# EAGLE design LS027B7DH01_Breakout (EAGLE 9.4.1)

## Sheet 1 of 2
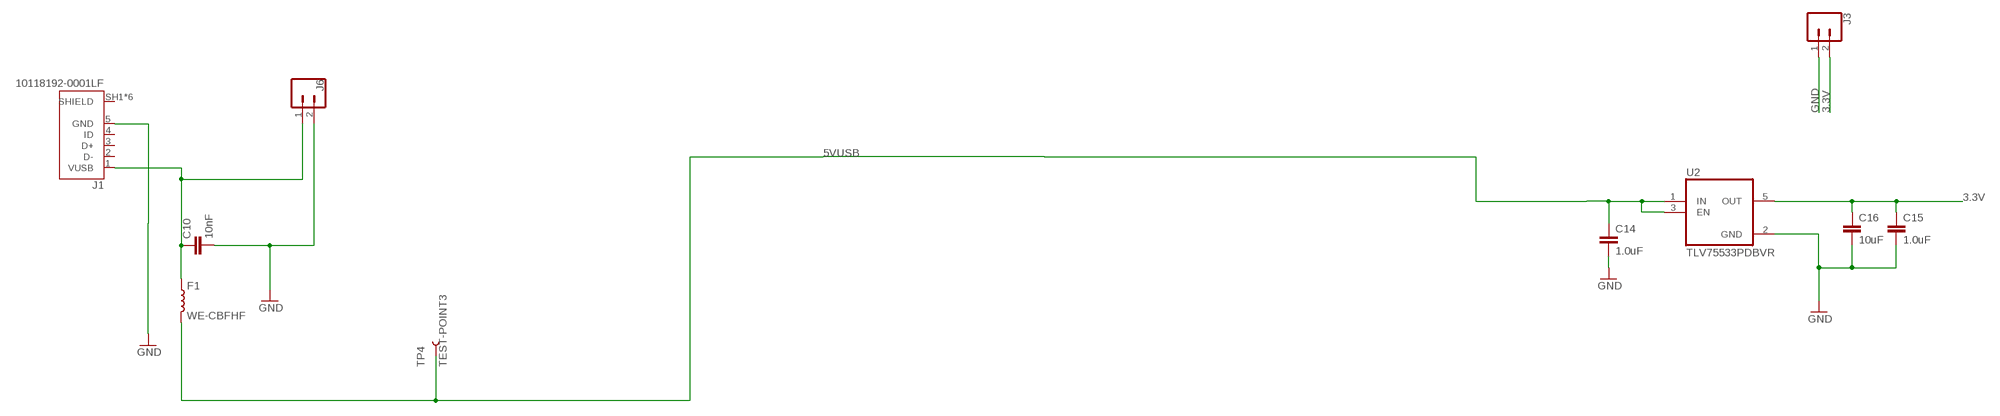
[diagram p0: schematic, sheet 1]

### Parts
C10  10nF  10NF-0603-50V-10%  [0603]
C14  1.0uF  SPARKFUN-CAPACITORS_1.0UF-0603-16V-10%  [SPARKFUN-CAPACITORS_0603]
C15  1.0uF  SPARKFUN-CAPACITORS_1.0UF-0603-16V-10%  [SPARKFUN-CAPACITORS_0603]
C16  10uF  10UF-0603-6.3V-20%  [0603]
F1  WE-CBFHF  [0603]
J1  10118192-0001LF  [AMPHENOL_10118192-0001LF]
J3  CONN_02  [1X02]
J6  CONN_02  [1X02]
TP4  TEST-POINT3  [PAD.03X.03]
U2  TLV75533PDBVR  [SOT95P280X145-5N]

### Nets
3.3V: C15.1 C16.1 J3.2 U2.5(OUT) ; also sheet 2
5VUSB [linear regulators]: C14.1 F1.2 TP4.P$1 U2.1(IN) U2.3(EN)
GND [ground]: C10.2 C14.2 C15.2 C16.2 J1.5(GND) J3.1 J6.2 U2.2(GND) ; also sheet 2
VBUS: C10.1 F1.1 J1.1(VUSB) J6.1
Unconnected: J1.2(D-) J1.3(D+) J1.4(ID) J1.SH1(SHIELD) J1.SH2(SHIELD) J1.SH3(SHIELD) J1.SH4(SHIELD) J1.SH5(SHIELD) J1.SH6(SHIELD)

## Sheet 2 of 2
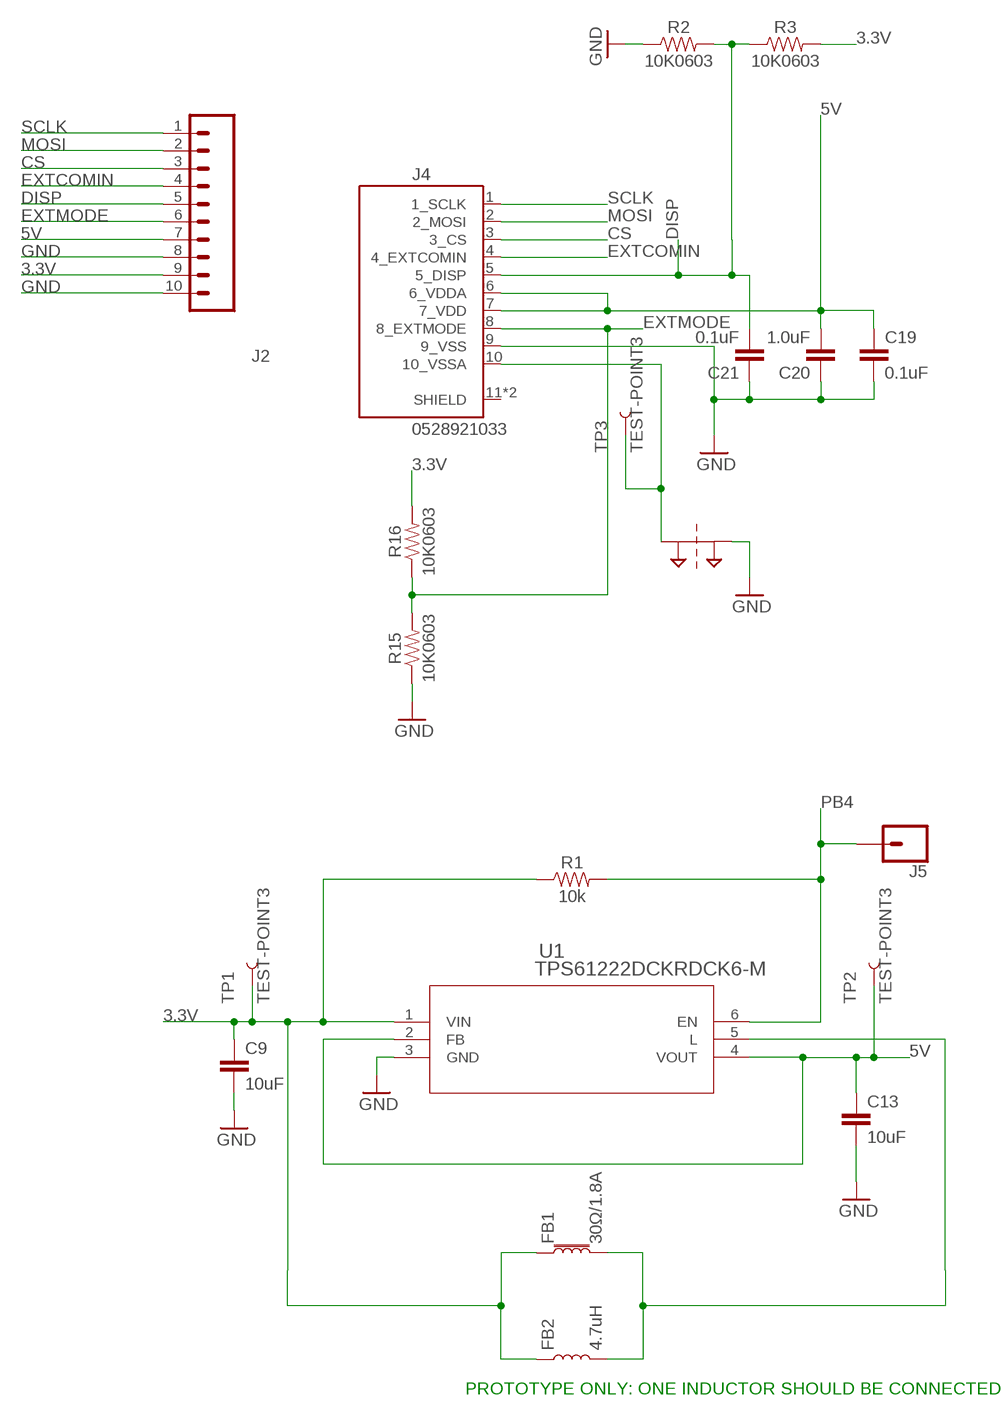
[diagram p1: schematic, sheet 2]

### Parts
C9  10uF  10UF-0603-6.3V-20%  [0603]
C13  10uF  10UF-0603-6.3V-20%  [0603]
C19  0.1uF  0.1UF-0603-25V-5%  [0603]
C20  1.0uF  1.0UF-0603-16V-10%  [0603]
C21  0.1uF  0.1UF-0603-25V-5%  [0603]
FB1  30Ω/1.8A  FERRITE_BEAD-0603  [0603]
FB2  4.7uH  CIG22H4R7MNE  [CIG22H4R7MNE]
J2  CONN_10"  [1X10]
J4  0528921033  [MOLEX_0528921033]
J5  CONN_01  [1X01]
R1  10k  SPARKFUN-RESISTORS_10KOHM-0603-1/10W-1%  [SPARKFUN-RESISTORS_0603:1]
R2  10K0603  [0603]
R3  10K0603  [0603]
R15  10K0603  [0603]
R16  10K0603  [0603]
SUPPLY1  2PT_GND_TIE  [2PT_GND_TIE]
TP1  TEST-POINT3  [PAD.03X.03]
TP2  TEST-POINT3  [PAD.03X.03]
TP3  TEST-POINT3  [PAD.03X.03]
U1  TPS61222DCKRDCK6-M  [DCK6-M]

### Nets
3.3V: C9.1 FB1.1 FB2.1 J2.9 R1.1 R3.2 R16.2 TP1.P$1 U1.1(VIN) ; also sheet 1
5V: C13.1 C19.1 C20.2 J2.7 J4.6(6_VDDA) J4.7(7_VDD) TP2.P$1 U1.2(FB) U1.4(VOUT)
ARTN [ground]: J4.10(10_VSSA) SUPPLY1.P$1 TP3.P$1
CS: J2.3 J4.3(3_CS)
DISP: C21.2 J2.5 J4.5(5_DISP) R2.2 R3.1
EXTCOMIN: J2.4 J4.4(4_EXTCOMIN)
EXTMODE: J2.6 J4.8(8_EXTMODE) R15.2 R16.1
GND [ground]: C9.2 C13.2 C19.2 C20.1 C21.1 J2.8 J2.10 J4.9(9_VSS) R2.1 R15.1 SUPPLY1.P$2 U1.3(GND) ; also sheet 1
MOSI: J2.2 J4.2(2_MOSI)
N$5: FB1.2 FB2.2 U1.5(L)
PB4: J5.1 R1.2 U1.6(EN)
SCLK: J2.1 J4.1(1_SCLK)
Unconnected: J4.11(SHIELD) J4.12(SHIELD)

### Notes on the sheet
- PROTOTYPE ONLY: ONE INDUCTOR SHOULD BE CONNECTED ONLY

## Library data of the parts
C9 C13 C16 = Octal:10UF: 10.0µF ceramic capacitors A capacitor is a passive two-terminal electrical component used to store electrical energy temporarily in an electric field.; PROD_ID: CAP-11015
C10 = SparkFun-Capacitors:10NF: 0.01uF/10nF/10,000pF ceramic capacitors A capacitor is a passive two-terminal electrical component used to store electrical energy temporarily in an electric field. CAP-09321; PROD_ID: CAP-00867
C14 C15 = Octal:SPARKFUN-CAPACITORS_1.0UF: 1µF ceramic capacitors A capacitor is a passive two-terminal electrical component used to store electrical energy temporarily in an electric field.; PROD_ID: CAP-00868
C19 C21 = SparkFun-Capacitors:0.1UF: 0.1µF ceramic capacitors A capacitor is a passive two-terminal electrical component used to store electrical energy temporarily in an electric field.; PROD_ID: CAP-08604
C20 = SparkFun-Capacitors:1.0UF: 1µF ceramic capacitors A capacitor is a passive two-terminal electrical component used to store electrical energy temporarily in an electric field.; PROD_ID: CAP-00868
F1 = scottohair Tantalum:WE-CBFHF
FB1 = SparkFun-Coils:FERRITE_BEAD: Ferrite Bead (blocks, cores, rings, chokes, etc.) Inductor with layers of ferrite used to suppress high frequencies. Often used to isolate high frequency noise. SparkFun Products: IOIO-OTG - V2.2 <https://www.sparkfun.com/products/13613> SparkFun SAMD21 Mini Breakout <https://www.sparkfun.com/products/13664> SparkFun 6 Degrees of Freedom Breakout - LSM6DS3 <https://www.sparkfun.com/products/13339> SparkFun SAMD21 Dev Breakout <https://www.sparkfun.com/products/13672>; PROD_ID: NDUC-07859
FB2 = Octal:CIG22H4R7MNE
J1 = Octal:10118192-0001LF: Single Port 5 Contact Horizontal Right Angle Shielded Micro B USB 2.0 Connector; AVAILABILITY: Unavailable; DESCRIPTION: Single Port 5 Contact Horizontal Right Angle Shielded Micro B USB 2.0 Connector; MF: Amphenol ICC; MP: 10118192-0001LF; PACKAGE: None; PRICE: None
J2 = SparkFun-Connectors:CONN_10: Multi connection point. Often used as Generic Header-pin footprint for 0.1 inch spaced/style header connections On any of the 0.1 inch spaced packages, you can populate with these: Break Away Headers - Straight <https://www.sparkfun.com/products/116> (PRT-00116) Break Away Male Headers - Right Angle <https://www.sparkfun.com/products/553> (PRT-00553) Female Headers <https://www.sparkfun.com/products/115> (PRT-00115) Break Away Headers - Machine Pin <https://www.sparkfun.com/products/117> (PRT-00117) Break Away Female Headers - Swiss Machine Pin <https://www.sparkfun.com/products/743> (PRT-00743) Arduino Stackable Header - 10 Pin <https://www.sparkfun.com/products/11376> (PRT-11376) For SCREWTERMINALS and SPRING TERMINALS visit here: Screw Terimnals on SparkFun.com <https://www.sparkfun.com/search/results?term=Screw+Terminals> (5mm/3.5mm/2.54mm spacing) This device is also useful as a general connection point to wire up your design to another part of your project. Our various solder wires solder well into these plated through hole pads. Hook-Up Wire - Assortment (Stranded, 22 AWG) <https://www.sparkfun.com/products/11375> (PRT-11375) Hook-Up Wire - Assortment (Solid Core, 22 AWG) <https://www.sparkfun.com/products/11367> (PRT-11367) View the entire wire category on our website here <https://www.sparkfun.com/categories/141> Special notes: Molex polarized connector foot print use with SKU : PRT-08231 with associated crimp pins and housings. 1MM SMD Version SKU: PRT-10208 NOTES ON THE VARIANTS LOCK and LOCK_LONGPADS... This footprint was designed to help hold the alignment of a through-hole component (i.e. 6-pin header) while soldering it into place. You may notice that each hole has been shifted either up or down by 0.005 of an inch from it's more standard position (which is a perfectly straight line). This slight alteration caused the pins (the squares in the middle) to touch the edges of the holes. Because they are alternating, it causes a "brace" to hold the component in place. 0.005 has proven to be the perfect amount of "off-center" position when using our standard breakaway headers. Although looks a little odd when you look at the bare footprint, once you have a header in there, the alteration is very hard to notice. Also,if you push a header all the way into place, it is covered up entirely on the bottom side.; PROD_ID: CONN-11563
J3 J6 = SparkFun-Connectors:CONN_02: Multi connection point. Often used as Generic Header-pin footprint for 0.1 inch spaced/style header connections On any of the 0.1 inch spaced packages, you can populate with these: Break Away Headers - Straight <https://www.sparkfun.com/products/116> (PRT-00116) Break Away Male Headers - Right Angle <https://www.sparkfun.com/products/553> (PRT-00553) Female Headers <https://www.sparkfun.com/products/115> (PRT-00115) Break Away Headers - Machine Pin <https://www.sparkfun.com/products/117> (PRT-00117) Break Away Female Headers - Swiss Machine Pin <https://www.sparkfun.com/products/743> (PRT-00743) For SCREWTERMINALS and SPRING TERMINALS visit here: Screw Terimnals on SparkFun.com <https://www.sparkfun.com/search/results?term=Screw+Terminals> (5mm/3.5mm/2.54mm spacing) This device is also useful as a general connection point to wire up your design to another part of your project. Our various solder wires solder well into these plated through hole pads. Hook-Up Wire - Assortment (Stranded, 22 AWG) <https://www.sparkfun.com/products/11375> (PRT-11375) Hook-Up Wire - Assortment (Solid Core, 22 AWG) <https://www.sparkfun.com/products/11367> (PRT-11367) View the entire wire category on our website here <https://www.sparkfun.com/categories/141> Special notes: Molex polarized connector foot print use with: PRT-08233 with associated crimp pins and housings. 2.54_SCREWTERM for use with PRT-10571. 3.5mm Screw Terminal footprints for PRT-08084 5mm Screw Terminal footprints for use with PRT-08432
J4 = Octal:0528921033: Conn FFC/FPC Connector SKT 10 POS 0.5mm Solder RA SMD Embossed T/R; AVAILABILITY: Unavailable; DESCRIPTION: Conn Ffc Bottom 10pos 0.50mm r/a; MF: Molex; MP: 0528921033; PACKAGE: None; PRICE: None
J5 = SparkFun-Connectors:CONN_01: Single connection point. Often used as Generic Header-pin footprint for 0.1 inch spaced/style header connections On any of the 0.1 inch spaced packages, you can populate with these: Break Away Headers - Straight <https://www.sparkfun.com/products/116> (PRT-00116) Break Away Male Headers - Right Angle <https://www.sparkfun.com/products/553> (PRT-00553) Female Headers <https://www.sparkfun.com/products/115> (PRT-00115) Break Away Headers - Machine Pin <https://www.sparkfun.com/products/117> (PRT-00117) Break Away Female Headers - Swiss Machine Pin <https://www.sparkfun.com/products/743> (PRT-00743) This device is also useful as a general connection point to wire up your design to another part of your project. Our various solder wires solder well into these plated through hole pads. Hook-Up Wire - Assortment (Stranded, 22 AWG) <https://www.sparkfun.com/products/11375> (PRT-11375) Hook-Up Wire - Assortment (Solid Core, 22 AWG) <https://www.sparkfun.com/products/11367> (PRT-11367) View the entire wire category on our website here <https://www.sparkfun.com/categories/141> Special notes: SMTSO-256-ET is a "flush mount" nut for a 4-40 screw. We mostly use this on specialty testbeds; it is a nice way to connect hardware to your PCB at an adjustable hieght. Also note, the SNAP packages are for using a snappable style connector. We sell a baggie of snaps and they are also used on two LilyPad designs: Snap Assortment - 30 pack (male and female) <https://www.sparkfun.com/products/11347> (DEV-11347) LilyPad Arduino SimpleSnap <https://www.sparkfun.com/products/10941> (DEV-10941) LilyPad SimpleSnap Protoboard <https://www.sparkfun.com/products/10940> (DEV-10940)
R1 = Octal:SPARKFUN-RESISTORS_10KOHM: 10kΩ resistor A resistor is a passive two-terminal electrical component that implements electrical resistance as a circuit element. Resistors act to reduce current flow, and, at the same time, act to lower voltage levels within circuits. - Wikipedia; PROD_ID: RES-00824
R2 R3 R15 R16 = scottohair Tantalum:10K: 10K resistor scottohair
SUPPLY1 = SparkFun-PowerSymbols:2PT_GND_TIE: Dual Ground Supply Power supply symbol for connecting two grounds. SparkFun Products: SparkFun AutoDriver - Stepper Motor Driver <https://www.sparkfun.com/products/11611>
TP1-TP4 = SparkFun-Connectors:TEST-POINT: SparkFun Test Points Bare copper test points for troubleshooting or In-Circuit-Testing. These are used by our Production team for verifying production board runs using pogo-pins on test beds. SparkFun Products: SparkFun LSM9DS1 Breakout <https://www.sparkfun.com/products/13284> SparkFun PSOC <https://www.sparkfun.com/products/13714> SparkFun Load Cell Amplifier <https://www.sparkfun.com/products/13879>
U1 = Octal:TPS61222DCKR; MANUFACTURER_PART_NUMBER: TPS61222DCKR; VENDOR: Texas Instruments
U2 = Octal:TLV75533PDBVR: 500mA Low-IQ Small-Size Low-Dropout (LDO) Regulator 5-SOT-23 -40 to 125; AVAILABILITY: Unavailable; DESCRIPTION: 500mA Low-IQ Small-Size Low-Dropout _LDO_ Regulator 5-SOT-23 -40 to 125; MF: Texas Instruments; MP: TLV75533PDBVR; PACKAGE: SOT-23 Texas Instruments; PRICE: None

## Net classes
1 ground: width 0.203 mm, clearance 0.203 mm
2 power: width 0.203 mm
3 cap sense: width 0.178 mm, clearance 0.635 mm
4 linear regulators: width 1.27 mm, clearance 0.381 mm
5 diff pair: width 0.203 mm

## Board
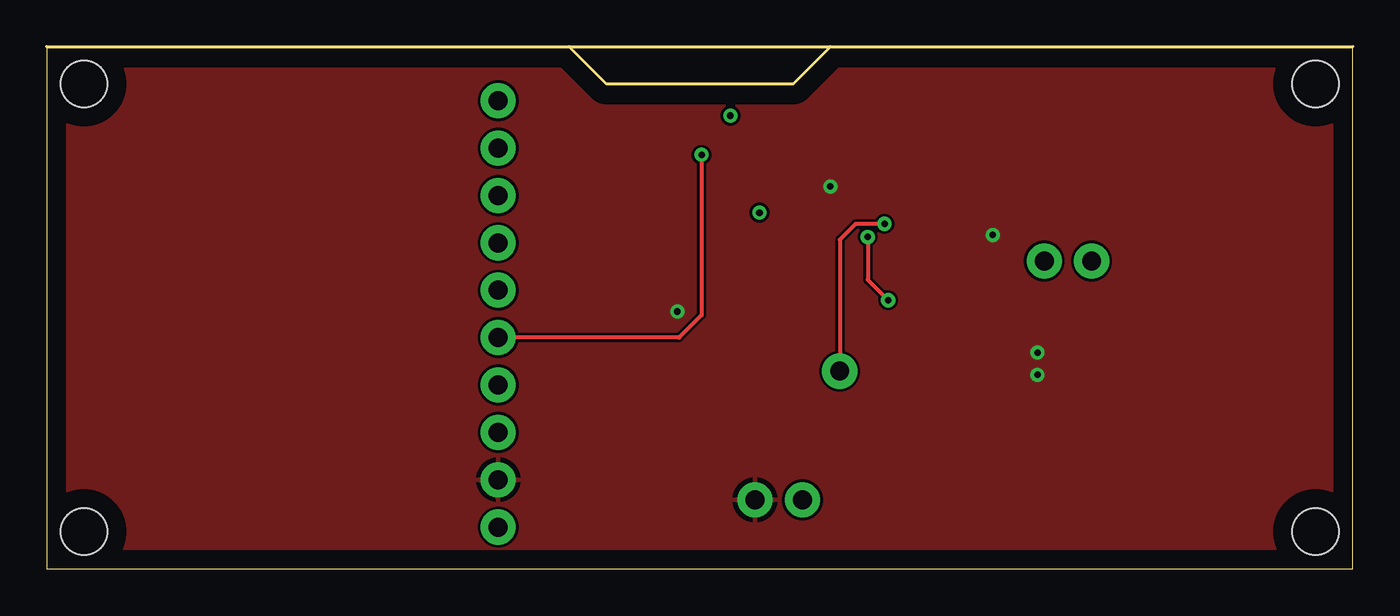
[diagram p2: board, top side]
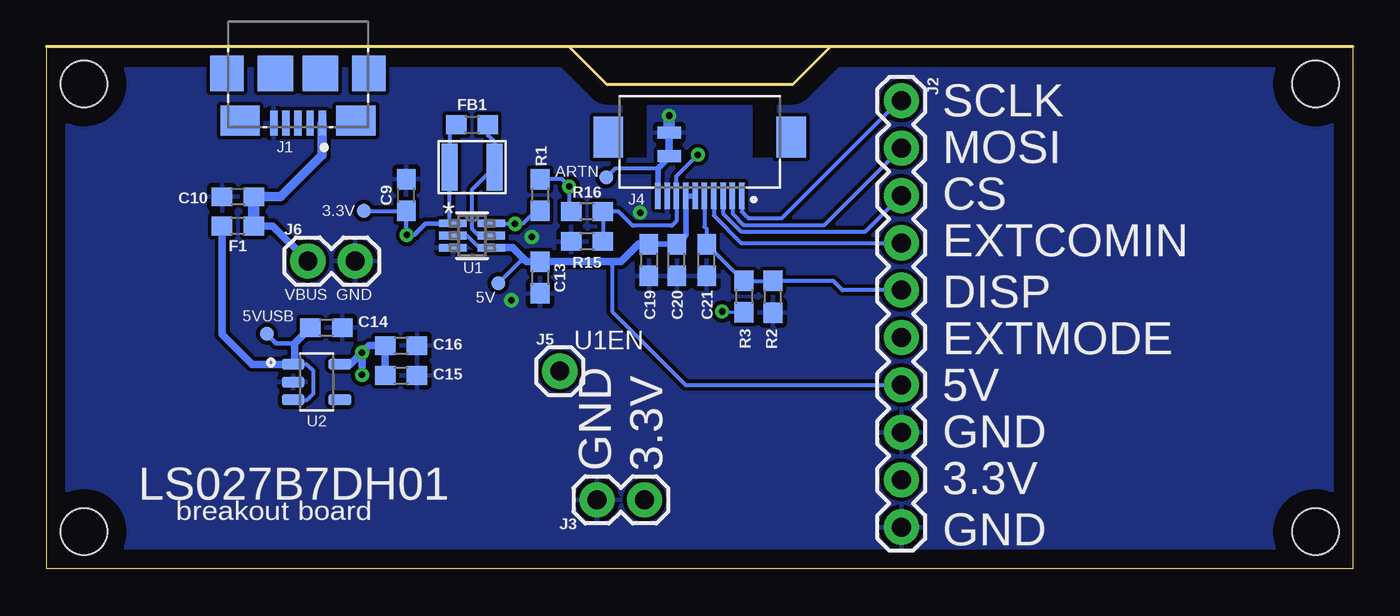
[diagram p3: board, bottom side, seen from below]

Size 70 x 28 mm. Coordinates in mm from the lower left corner, seen from the top.
Outline: 28,28 0,28 0,20 0,0 70,0 70,20 70,28 42,28
Outline: 28,28 42,28
Outline: 42,28 40,26 30,26 28,28
Outline: 28,28 42,28
Copper layers (1*16): Top 0.035mm / dielectric 0.2mm / Bottom 0.035mm
Design rules "default *": minimum track width 6mil, minimum drill 0.35mm, track to track 6mil, track to pad 6mil, pad to pad 6mil, via to via 6mil, smd to smd 6mil, copper to edge 40mil, drill to drill 6mil, minimum pad ring 10mil, minimum via ring 8mil, stop-mask expansion 4mil, vias tented up to drill 0mil, thermal gap 10mil
Holes 2.5 mm at 2,26 68,26 2,2 68,2

### Footprints (pad centres in the part's own frame; a part is rotated, then mirrored left to right if it is on the bottom)
0603 = smd 1.1 x 1: 1 -0.85,0; 2 0.85,0
SPARKFUN-CAPACITORS_0603 = smd 1.1 x 1: 1 -0.85,0; 2 0.85,0
CIG22H4R7MNE = smd 0.85 x 2.5: 1 -1.2,0; 2 1.2,0
AMPHENOL_10118192-0001LF = smd 0.4 x 1.35: 1 -1.3,0; 2 -0.65,0; 3 0,0; 4 0.65,0; 5 1.3,0 | smd 2.1 x 1.6: SH1 -3.1,-0.125; SH2 3.1,-0.125 | smd 1.8 x 1.9: SH3 -3.8,-2.675; SH6 3.8,-2.675 | smd 1.9 x 1.9: SH4 -1.2,-2.675; SH5 1.2,-2.675
1X10 = drill 1.016 pad 1.88: 1 0,0; 2 2.54,0; 3 5.08,0; 4 7.62,0; 5 10.16,0; 6 12.7,0; 7 15.24,0; 8 17.78,0; 9 20.32,0; 10 22.86,0
1X02 = drill 1.016 pad 1.88: 1 0,0; 2 2.54,0
MOLEX_0528921033 = smd 0.3 x 1.4: 1 -2.25,0; 2 -1.75,0; 3 -1.25,0; 4 -0.75,0; 5 -0.25,0; 6 0.25,0; 7 0.75,0; 8 1.25,0; 9 1.75,0; 10 2.25,0 | smd 1.6 x 2.2: 11 -4.9,-3.15; 12 4.9,-3.15
1X01 = drill 1.016 pad 1.88: 1 0,0
SPARKFUN-RESISTORS_0603:1 = smd 1.1 x 1: 1 -0.85,0; 2 0.85,0
2PT_GND_TIE = smd 1.27 x 0.635: P$1 0,0.635; P$2 0,-0.635
PAD.03X.03 = smd 0.762 x 0.762: P$1 0,0
DCK6-M = smd 1.457 x 0.405: 1 -1.028,0.65; 2 -1.028,0; 3 -1.028,-0.65; 4 1.028,-0.65; 5 1.028,0; 6 1.028,0.65
SOT95P280X145-5N = smd 1.21 x 0.59: 1 -1.255,0.95; 2 -1.255,0; 3 -1.255,-0.95; 4 1.255,-0.95; 5 1.255,0.95

### Placement (x,y rotation side)
C9  50.73,20.04 90 bottom
C10  59.75,19.95 180 bottom
C13  43.56,15.62 270 bottom
C14  55.01,12.93 0 bottom
C15  51,10.37 0 bottom
C16  51,11.97 0 bottom
C19  37.73,16.56 270 bottom
C20  36.23,16.56 90 bottom
C21  34.63,16.56 90 bottom
F1  59.75,18.38 180 bottom
FB1  47.2,23.82 0 bottom
FB2  47.2,21.54 0 bottom
J1  56.53,23.9 180 bottom
J2  24.2,25.1 270 bottom
J3  40.5,3.7 0 bottom
J4  35,20 180 bottom
J5  42.5,10.6 0 bottom
J6  56,16.5 0 bottom
R1  43.56,20.04 270 bottom
R2  31.08,14.59 90 bottom
R3  32.63,14.61 270 bottom
R15  41.04,17.56 0 bottom
R16  41.04,19.16 180 bottom
SUPPLY1  36.64,22.76 180 bottom
TP1  53,19.2 0 bottom
TP2  45.8,15.3 0 bottom
TP3  40,21 0 bottom
TP4  58.2,12.6 0 bottom
U1  47.2,17.87 0 bottom
U2  55.54,10.02 0 bottom

### Tracks (layer width: path | path; a pad name or v marks a point on that pad's centre or on a via)
3.3V  (via drill 0.35)
  Bottom 0.152: R3.2 33.76,13.76 v33.8,13.8
  Bottom 0.203: R1.1 42.39,20.89 v42,20.5 42,19.27 R16.2 | FB1.1 48.4,23.47 48.4,21.8 | 48.4,21.8 FB2.1 | U1.1 48.4,18.69 48.4,21.8 | TP1.P$1 C9.1
  Bottom 0.254: C9.1 50.73,17.93 | 50.73,17.93 v50.7,17.9 | U1.1 49.68,18.52 50.27,17.93 50.73,17.93
  Bottom 0.406: C15.1 C16.1 52.73,11.97 v53.1,11.6 | U2.5 53.73,10.97 v53.1,11.6 | v53.1,11.6 v53.1,10.4
  pour Top: 70,28 0,28 0,0 70,0
5V
  Bottom 0.203: U1.2 47.47,17.87 46.82,17.22 U1.4 | 39.7,16.47 39.7,13.8 35.76,9.86 J2.7 | C13.1 44.63,16.47 TP2.P$1
  Bottom 0.305: C19.1 C20.2 35.75,17.89 J4.7 J4.6
  Bottom 0.406: U1.4 45.02,17.22 44.27,16.47 C13.1 42.5,16.47 39.7,16.47 39.23,16.47 38.29,17.41 C19.1
5VUSB
  Bottom 0.203: U2.3 56.03,9.07 55.7,9.4 55.7,10.6 56.07,10.97 56.7,10.97 U2.1
  Bottom 0.254: TP4.P$1 57.69,12.09 56.7,12.09
  Bottom 0.406: 60.56,18.34 F1.2 60.6,12.57 59,10.97 U2.1 | C14.1 56.7,12.09 56.7,10.97
ARTN
  Bottom 0.203: 37.25,21.45 39.55,21.45 TP3.P$1
  Bottom 0.305: J4.10 37.25,21.45 36.64,22.06 SUPPLY1.P$1
CS
  Bottom 0.203: J4.3 33.75,19.05 32.79,18.09 26.13,18.09 J2.3
DISP
  Bottom 0.203: J4.5 34.75,18.35 34.63,18.23 C21.2 32.68,15.46 R3.1 32.61,15.44 R2.2 27.84,15.44 27.34,14.94 J2.5
EXTCOMIN
  Bottom 0.203: J4.4 34.25,18.95 32.78,17.48 J2.4
EXTMODE  (via drill 0.35)
  Top 0.203: v35.1,22.2 35.1,13.6 33.9,12.4 J2.6
  Bottom 0.203: R15.2 R16.1 39.36,19.16 38.6,18.4 36.5,18.4 36.25,18.65 J4.8 36.25,21.05 36.2,21.1 v35.1,22.2
GND  (via drill 0.35)
  Top 0.203: v44,17.8 44,15.5 v45.1,14.4
  Bottom 0.61: v36.64,24.3 SUPPLY1.P$2
  other vias: 38.2,19.1
  pour Bottom (rank 2): 0,28 70,28 70,0 0,0
MOSI
  Bottom 0.203: J2.2 28.32,18.44 32.64,18.44 33.24,19.04 J4.2
N$5
  Bottom 0.203: FB1.2 46.35,23.25 46,22.9 FB2.2 47.2,20.34 47.2,18.22 46.85,17.87 U1.5
PB4  (via drill 0.35)
  Top 0.203: v44.9,18.5 43.35,18.5 42.5,17.65 J5.1
  Bottom 0.203: R1.2 43.81,19.19 44.5,18.5 v44.9,18.5 46.15,18.5 U1.6
SCLK
  Bottom 0.203: J4.1 32.75,19.15 32.6,19 32.4,18.8 30.6,18.8 24.3,25.1 J2.1
VBUS
  Bottom 0.406: J6.1 57.88,18.38 F1.1
  Bottom 0.508: C10.1 57.45,19.95 55.23,22.17 J1.1
  Bottom 0.61: C10.1 F1.1

### Text on the board
bNames: SCLK | MOSI | ARTN | CS | 3.3V | EXTCOMIN | DISP | 5V | GND | VBUS | 5VUSB | EXTMODE | U1EN | 5V | GND | 3.3V | GND | 3.3V | LS027B7DH01 | breakout board | GND
bValues: rev 1